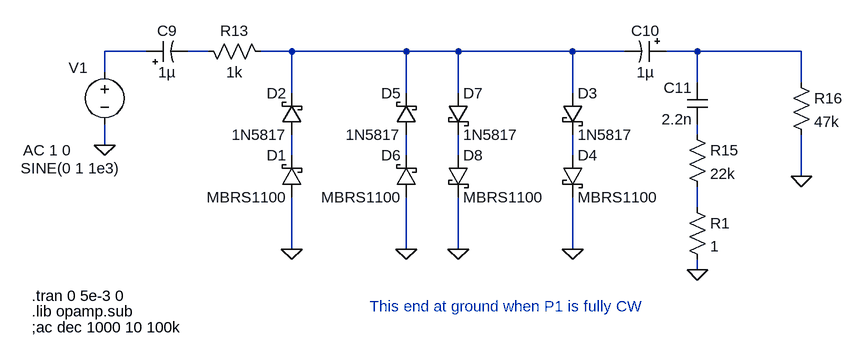
[diagram p0: schematic Klon-Centaur_diodes_w_filter_v3.asc]
Klon-Centaur_diodes_w_filter_v3.asc, the LTspice schematic file:
Version 4
SHEET 1 4496 5064
WIRE 960 2544 896 2544
WIRE 1056 2544 1024 2544
WIRE 1184 2544 1136 2544
WIRE 1360 2544 1184 2544
WIRE 1440 2544 1360 2544
WIRE 1616 2544 1440 2544
WIRE 1696 2544 1616 2544
WIRE 1808 2544 1760 2544
WIRE 1968 2544 1808 2544
WIRE 896 2576 896 2544
WIRE 1808 2592 1808 2544
WIRE 1968 2592 1968 2544
WIRE 1184 2608 1184 2544
WIRE 1360 2608 1360 2544
WIRE 1440 2608 1440 2544
WIRE 1616 2608 1616 2544
WIRE 1808 2672 1808 2656
WIRE 896 2688 896 2656
WIRE 1184 2704 1184 2672
WIRE 1360 2704 1360 2672
WIRE 1440 2704 1440 2672
WIRE 1616 2704 1616 2672
WIRE 1968 2736 1968 2672
WIRE 1808 2784 1808 2752
WIRE 1184 2848 1184 2768
WIRE 1360 2848 1360 2768
WIRE 1440 2848 1440 2768
WIRE 1616 2848 1616 2768
WIRE 1808 2880 1808 2864
FLAG 1616 2848 0
FLAG 1184 2848 0
FLAG 896 2688 0
FLAG 1808 2880 0
FLAG 1968 2736 0
FLAG 1360 2848 0
FLAG 1440 2848 0
SYMBOL voltage 896 2560 R0
WINDOW 0 -55 9 Left 2
WINDOW 123 -125 136 Left 2
WINDOW 39 0 0 Left 0
WINDOW 3 -129 164 Left 2
SYMATTR InstName V1
SYMATTR Value2 AC 1 0
SYMATTR Value SINE(0 1 1e3)
SYMBOL res 1152 2560 M270
WINDOW 0 32 56 VTop 2
WINDOW 3 0 56 VBottom 2
SYMATTR InstName R13
SYMATTR Value 1k
SYMBOL cap 1824 2592 M0
SYMATTR InstName C11
SYMATTR Value 2.2n
SYMBOL res 1792 2656 R0
SYMATTR InstName R15
SYMATTR Value 22k
SYMBOL schottky 1200 2672 R180
WINDOW 0 24 64 Left 2
WINDOW 3 24 0 Left 2
SYMATTR InstName D2
SYMATTR Value 1N5817
SYMATTR Description Diode
SYMATTR Type diode
SYMBOL schottky 1600 2608 R0
SYMATTR InstName D3
SYMATTR Value 1N5817
SYMATTR Description Diode
SYMATTR Type diode
SYMBOL polcap 960 2560 R270
WINDOW 0 32 32 VTop 2
WINDOW 3 0 32 VBottom 2
SYMATTR InstName C9
SYMATTR Value 1µ
SYMBOL polcap 1760 2528 R90
WINDOW 0 0 32 VBottom 2
WINDOW 3 32 32 VTop 2
SYMATTR InstName C10
SYMATTR Value 1µ
SYMBOL res 1792 2768 R0
SYMATTR InstName R1
SYMATTR Value 1
SYMBOL res 1952 2576 R0
SYMATTR InstName R16
SYMATTR Value 47k
SYMBOL schottky 1200 2768 R180
WINDOW 0 24 64 Left 2
WINDOW 3 24 0 Left 2
SYMATTR InstName D1
SYMATTR Value MBRS1100
SYMATTR Description Diode
SYMATTR Type diode
SYMBOL schottky 1600 2704 R0
SYMATTR InstName D4
SYMATTR Value MBRS1100
SYMATTR Description Diode
SYMATTR Type diode
SYMBOL schottky 1376 2672 R180
WINDOW 0 24 64 Left 2
WINDOW 3 24 0 Left 2
SYMATTR InstName D5
SYMATTR Value 1N5817
SYMATTR Description Diode
SYMATTR Type diode
SYMBOL schottky 1376 2768 R180
WINDOW 0 24 64 Left 2
WINDOW 3 24 0 Left 2
SYMATTR InstName D6
SYMATTR Value MBRS1100
SYMATTR Description Diode
SYMATTR Type diode
SYMBOL schottky 1424 2608 R0
SYMATTR InstName D7
SYMATTR Value 1N5817
SYMATTR Description Diode
SYMATTR Type diode
SYMBOL schottky 1424 2704 R0
SYMATTR InstName D8
SYMATTR Value MBRS1100
SYMATTR Description Diode
SYMATTR Type diode
TEXT 784 2944 Left 2 !.lib opamp.sub
TEXT 784 2968 Left 2 !;ac dec 1000 10 100k
TEXT 1304 2936 Left 2 ;This end at ground when P1 is fully CW
TEXT 784 2920 Left 2 !.tran 0 5e-3 0

The netlist it stands for:
* Klon-Centaur_diodes_w_filter_v3.asc
V1 N001 0 SINE(0 1 1e3) AC 1 0
R13 N003 N002 1k
C11 N004 N005 2.2n
R15 N005 N010 22k
D2 N006 N003 1N5817
D3 N003 N009 1N5817
C9 N001 N002 1µ
C10 N004 N003 1µ
R1 N010 0 1
R16 N004 0 47k
D1 0 N006 MBRS1100
D4 N009 0 MBRS1100
D5 N007 N003 1N5817
D6 0 N007 MBRS1100
D7 N003 N008 1N5817
D8 N008 0 MBRS1100
.model D D
.lib standard.dio
.lib opamp.sub
;ac dec 1000 10 100k
* This end at ground when P1 is fully CW
.tran 0 5e-3 0
.backanno
.end